# EAGLE schematic S140039_EMS_3HP_DS (EAGLE 6.5.0)

## Sheet 1 of 8: Backplane Layout
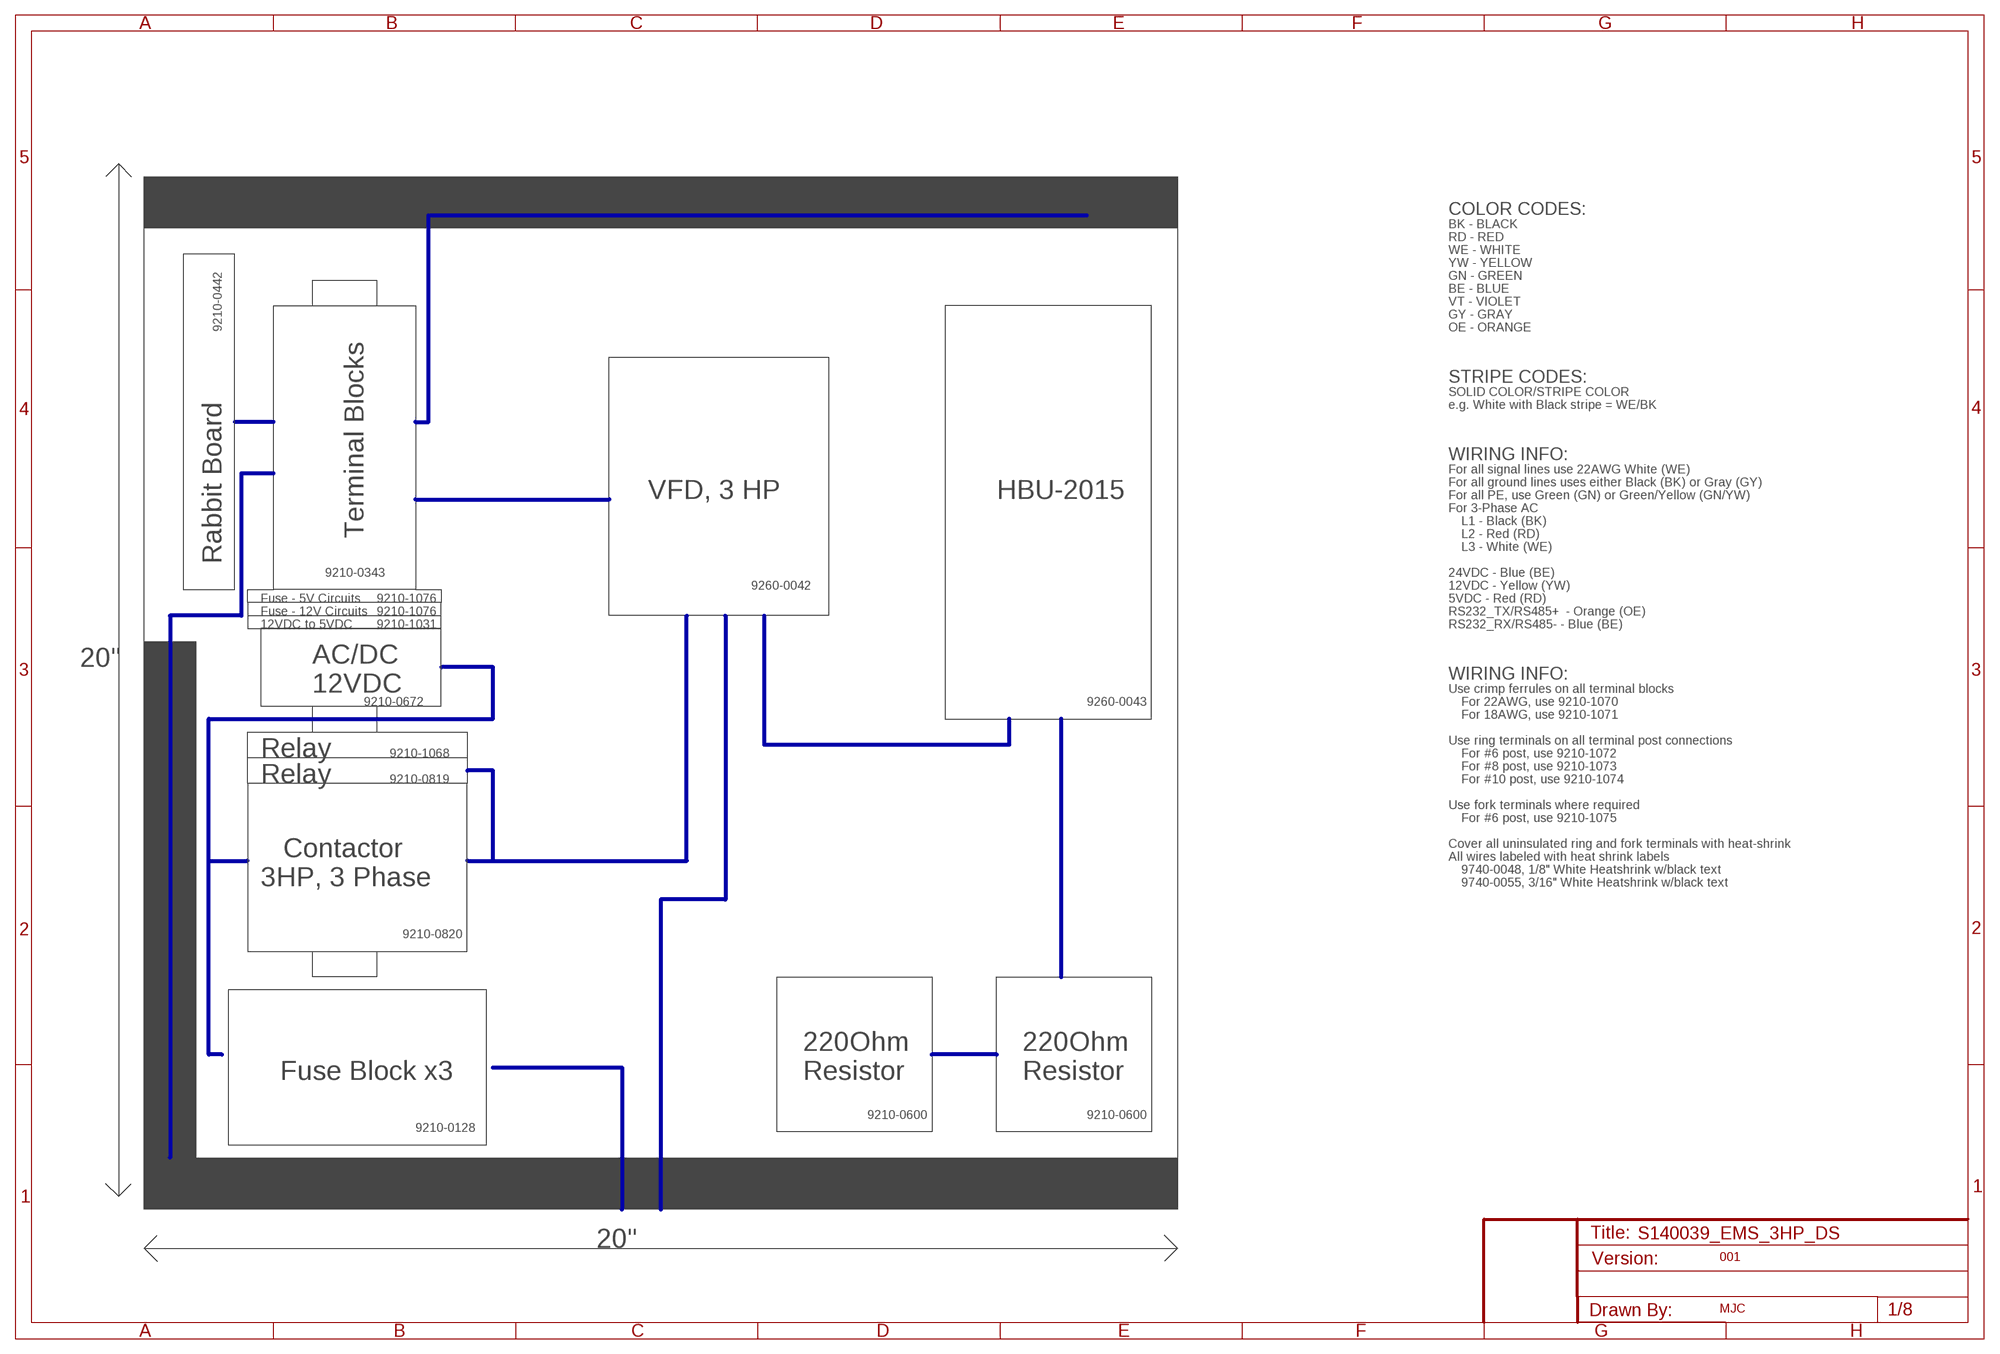
[diagram p0: schematic, sheet 1]

### Buses
B$1
B$2
B$3
B$6
B$7
B$8
B$9
B$10
B$11
B$12
B$4

### Notes on the sheet
- COLOR CODES:
- BK - BLACK
- RD - RED
- WE - WHITE
- YW - YELLOW
- GN - GREEN
- BE - BLUE
- VT - VIOLET
- GY - GRAY
- 9210-0442 | OE - ORANGE
- STRIPE CODES:
- SOLID COLOR/STRIPE COLOR
- e.g. White with Black stripe = WE/BK
- WIRING INFO:
- For all signal lines use 22AWG White (WE)
- For all ground lines uses either Black (BK) or Gray (GY)
- VFD, 3 HP | HBU-2015 | For all PE, use Green (GN) or Green/Yellow (GN/YW)
- For 3-Phase AC
- L1 - Black (BK)
- Terminal Blocks | L2 - Red (RD)
- L3 - White (WE)
- Rabbit Board
- 9210-0343 | 24VDC - Blue (BE)
- 9260-0042 | 12VDC - Yellow (YW)
- Fuse - 5V Circuits | 9210-1076 | 5VDC - Red (RD)
- Fuse - 12V Circuits | 9210-1076 | RS232_TX/RS485+  - Orange (OE)
- 12VDC to 5VDC | 9210-1031 | RS232_RX/RS485- - Blue (BE)
- 20"
- WIRING INFO:
- AC/DC 
  12VDC
- Use crimp ferrules on all terminal blocks
- 9210-0672 | 9260-0043 | For 22AWG, use 9210-1070
- For 18AWG, use 9210-1071
- Use ring terminals on all terminal post connections
- Relay | 9210-1068 | For #6 post, use 9210-1072
- For #8 post, use 9210-1073
- Relay | 9210-0819 | For #10 post, use 9210-1074
- Use fork terminals where required
- For #6 post, use 9210-1075
- Cover all uninsulated ring and fork terminals with heat-shrink
- All wires labeled with heat shrink labels
- 9740-0048, 1/8" White Heatshrink w/black text
- Contactor
  3HP, 3 Phase
- 9740-0055, 3/16" White Heatshrink w/black text
- 9210-0820
- Fuse Block x3
- 220Ohm
  Resistor
- 220Ohm
  Resistor
- 9210-0600 | 9210-0600
- 9210-0128
- 20"
- 001
- MJC

## Sheet 2 of 8: Terminal Blocks
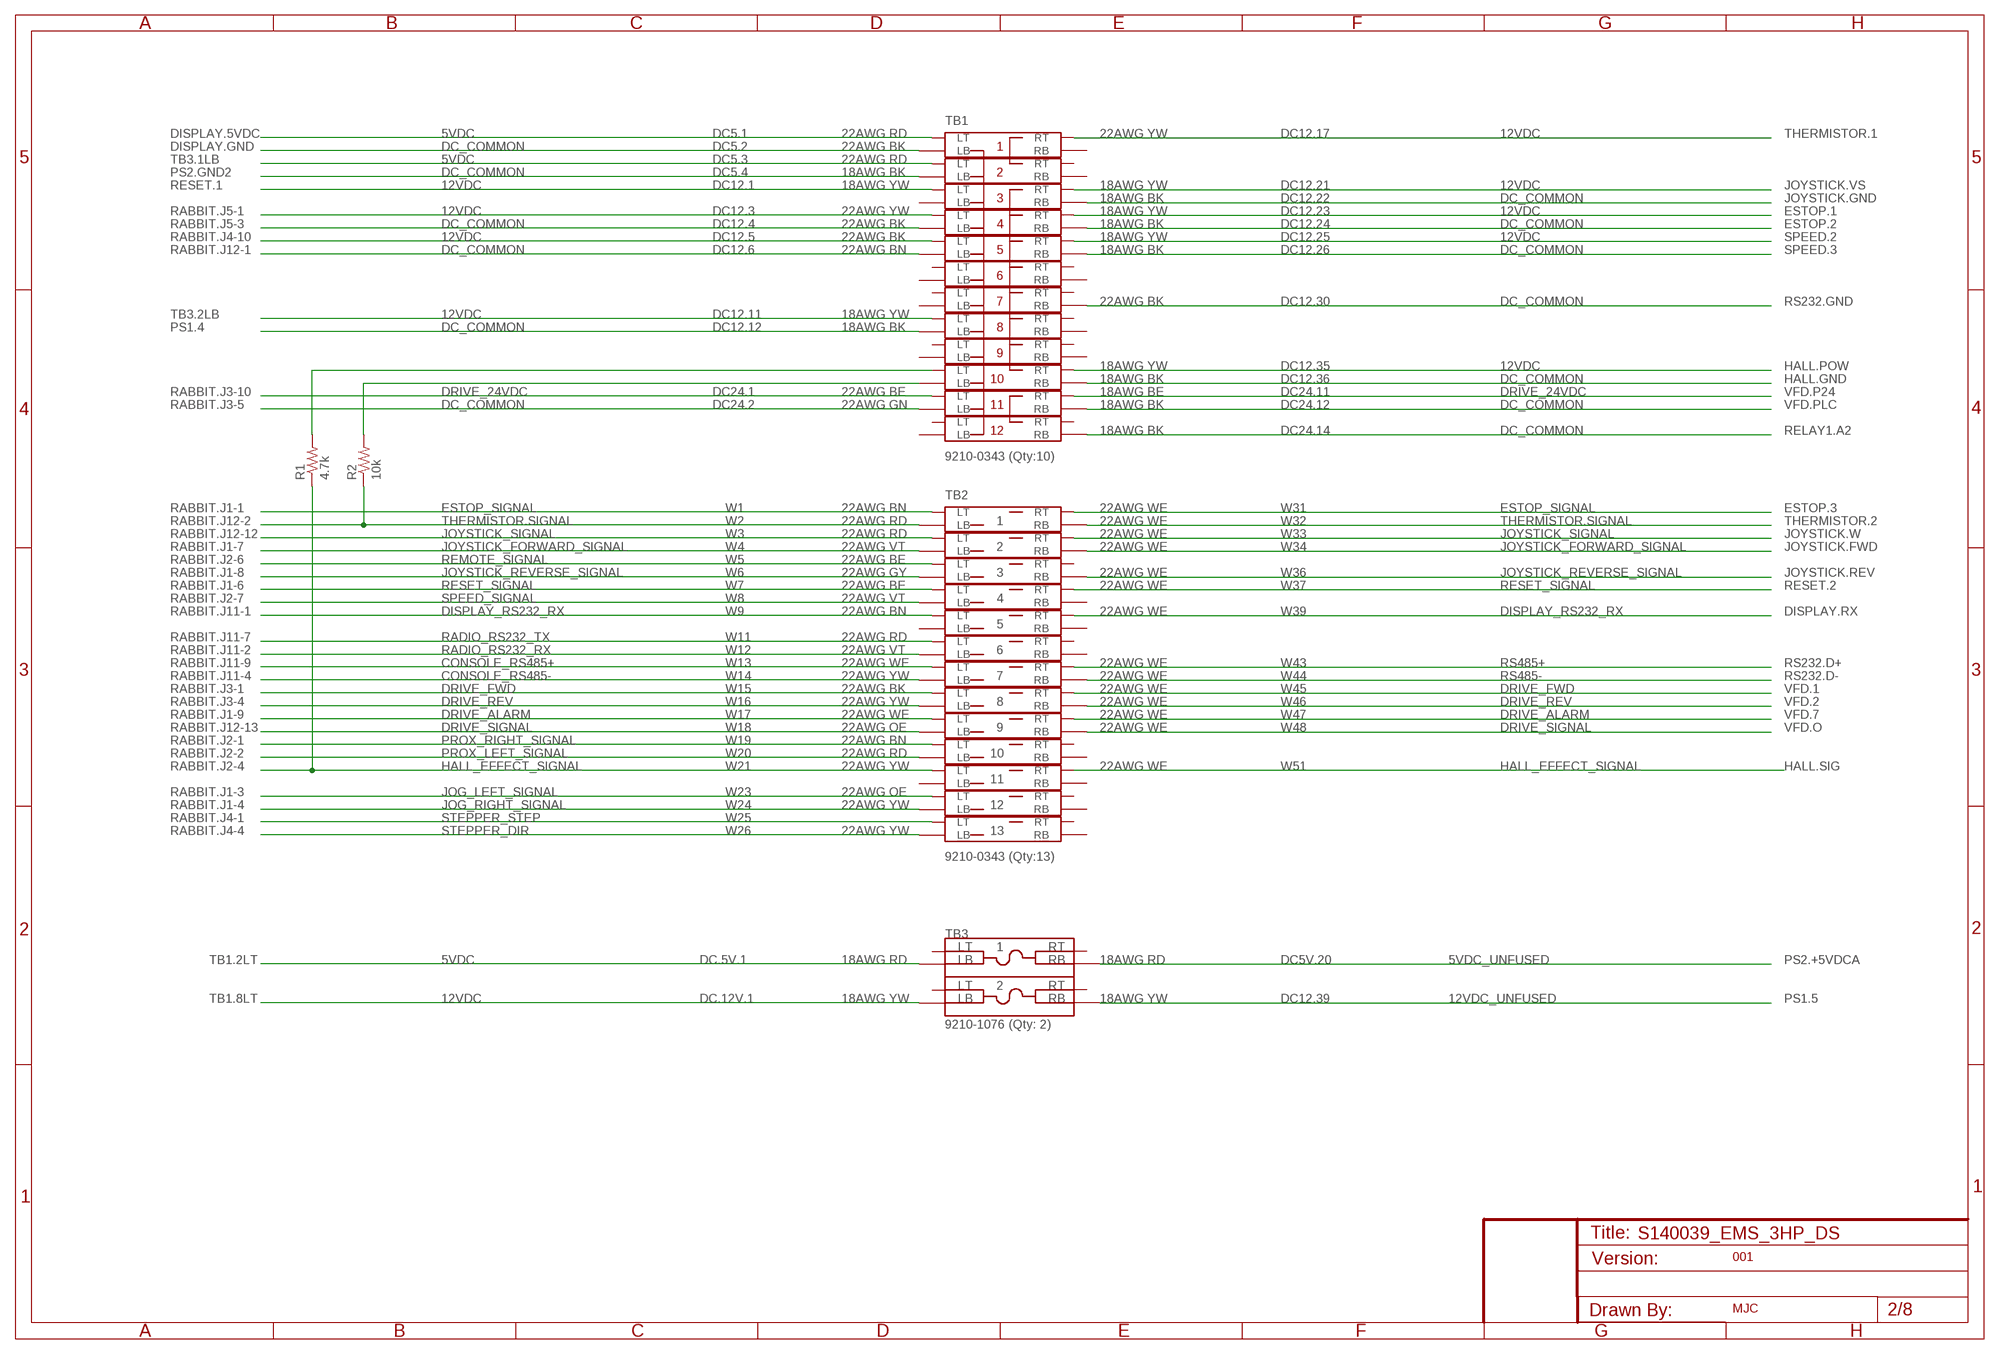
[diagram p1: schematic, sheet 2]

### Parts
R1  4.7k  R-US_0204/5  [0204/5]
R2  10k  R-US_0204/5  [0204/5]
U$1  TB_3031160_1POS  [BOGUS]
U$2  TB_3031160_1POS  [BOGUS]
U$4  TB_3031160_1POS  [BOGUS]
U$7  TB_3031160_1POS  [BOGUS]
U$8  TB_3031160_1POS  [BOGUS]
U$9  TB_FUSE_DDFL4ULR  [BOGUS]
U$10  TB_FUSE_DDFL4ULR  [BOGUS]
U$16  TB_3031160_1POS  [BOGUS]
U$17  TB_3031160_1POS  [BOGUS]
U$18  TB_3031160_1POS  [BOGUS]
U$19  TB_3031160_1POS  [BOGUS]
U$20  TB_3031160_1POS  [BOGUS]
U$21  TB_3031160_1POS  [BOGUS]
U$22  TB_3031160_1POS  [BOGUS]
U$23  TB_3031160_1POS  [BOGUS]
U$24  TB_3031160_1POS  [BOGUS]
U$25  TB_3031160_1POS  [BOGUS]
U$26  TB_3031160_1POS  [BOGUS]
U$27  TB_3031160_1POS  [BOGUS]
U$28  TB_3031160_1POS  [BOGUS]
U$29  TB_3031160_1POS  [BOGUS]
U$30  TB_3031160_1POS  [BOGUS]
U$31  TB_3031160_1POS  [BOGUS]
U$32  TB_3031160_1POS  [BOGUS]
U$33  TB_3031160_1POS  [BOGUS]
U$34  TB_3031160_1POS  [BOGUS]
U$35  TB_3031160_1POS  [BOGUS]

### Nets
5VDC: U$9.P$2 U$34.P$2(LT) U$35.P$2(LT) ; also sheet 7
5VDC_UNFUSED: U$9.P$4 ; also sheet 3
12VDC: U$8.P$4(RT) U$10.P$2 U$28.P$2(LT) U$31.P$2(LT) U$31.P$4(RT) U$32.P$2(LT) U$32.P$4(RT) U$33.P$2(LT) U$33.P$4(RT) U$35.P$4(RT) ; also sheet 4,6,7,8
12VDC_UNFUSED: U$10.P$4 ; also sheet 3
CONSOLE_RS485+: U$21.P$2(LT) ; also sheet 4,7
CONSOLE_RS485-: U$21.P$1(LB) ; also sheet 4,7
DC_COMMON: U$8.P$3(RB) U$26.P$3(RB) U$27.P$1(LB) U$27.P$3(RB) U$28.P$1(LB) U$29.P$3(RB) U$31.P$1(LB) U$31.P$3(RB) U$32.P$1(LB) U$32.P$3(RB) U$33.P$3(RB) U$34.P$1(LB) U$35.P$1(LB) ; also sheet 3,4,5,6,7,8
DISPLAY_RS232_RX: U$19.P$2(LT) U$19.P$4(RT) ; also sheet 7
DRIVE_24VDC: U$27.P$2(LT) U$27.P$4(RT) ; also sheet 4,5
DRIVE_ALARM: U$23.P$2(LT) U$23.P$4(RT) ; also sheet 4,5
DRIVE_FWD: U$22.P$2(LT) U$22.P$4(RT) ; also sheet 4,5
DRIVE_REV: U$22.P$1(LB) U$22.P$3(RB) ; also sheet 4,5
DRIVE_SIGNAL: U$23.P$1(LB) U$23.P$3(RB) ; also sheet 4,5
ESTOP_SIGNAL: U$4.P$2(LT) U$4.P$4(RT) ; also sheet 3,4,7
HALL_EFFECT_SIGNAL: R1.1 U$25.P$2(LT) U$25.P$4(RT) ; also sheet 4,8
JOG_LEFT_SIGNAL: U$1.P$2(LT) ; also sheet 4
JOG_RIGHT_SIGNAL: U$1.P$1(LB) ; also sheet 4
JOYSTICK_FORWARD_SIGNAL: U$16.P$1(LB) U$16.P$3(RB) ; also sheet 4,7
JOYSTICK_REVERSE_SIGNAL: U$17.P$1(LB) U$17.P$3(RB) ; also sheet 4,7
JOYSTICK_SIGNAL: U$16.P$2(LT) U$16.P$4(RT) ; also sheet 4,7
N$1: R2.2 U$8.P$1(LB)
N$2: R1.2 U$8.P$2(LT)
PROX_LEFT_SIGNAL: U$24.P$1(LB) ; also sheet 4,8
PROX_RIGHT_SIGNAL: U$24.P$2(LT) ; also sheet 4,8
RADIO_RS232_RX: U$20.P$1(LB) ; also sheet 4
RADIO_RS232_TX: U$20.P$2(LT) ; also sheet 4
REMOTE_SIGNAL: U$17.P$2(LT) ; also sheet 4
RESET_SIGNAL: U$18.P$2(LT) U$18.P$4(RT) ; also sheet 4,7
RS485+: U$21.P$4(RT)
RS485-: U$21.P$3(RB)
SPEED_SIGNAL: U$18.P$1(LB) ; also sheet 4
STEPPER_DIR: U$2.P$1(LB) ; also sheet 4
STEPPER_STEP: U$2.P$2(LT) ; also sheet 4
THERMISTOR.SIGNAL: R2.1 U$4.P$1(LB) U$4.P$3(RB) ; also sheet 4,6
Unconnected: U$1.P$3(RB) U$1.P$4(RT) U$2.P$3(RB) U$2.P$4(RT) U$7.P$1(LB) U$7.P$2(LT) U$7.P$3(RB) U$7.P$4(RT) U$9.P$1 U$9.P$3 U$10.P$1 U$10.P$3 U$17.P$4(RT) U$18.P$3(RB) U$19.P$1(LB) U$19.P$3(RB) U$20.P$3(RB) U$20.P$4(RT) U$24.P$3(RB) U$24.P$4(RT) U$25.P$1(LB) U$25.P$3(RB) U$26.P$1(LB) U$26.P$2(LT) U$26.P$4(RT) U$28.P$3(RB) U$28.P$4(RT) U$29.P$1(LB) U$29.P$2(LT) U$29.P$4(RT) U$30.P$1(LB) U$30.P$2(LT) U$30.P$3(RB) U$30.P$4(RT) U$33.P$1(LB) U$34.P$3(RB) U$34.P$4(RT) U$35.P$3(RB)

### Notes on the sheet
- TB1
- DISPLAY.5VDC | DC5.1 | 22AWG RD | 22AWG YW | DC12.17 | THERMISTOR.1
- DISPLAY.GND | DC5.2 | 22AWG BK | 1
- TB3.1LB | DC5.3 | 22AWG RD
- PS2.GND2 | DC5.4 | 18AWG BK | 2
- RESET.1 | DC12.1 | 18AWG YW | 18AWG YW | DC12.21 | JOYSTICK.VS
- 3 | 18AWG BK | DC12.22 | JOYSTICK.GND
- RABBIT.J5-1 | DC12.3 | 22AWG YW | 18AWG YW | DC12.23 | ESTOP.1
- RABBIT.J5-3 | DC12.4 | 22AWG BK | 4 | 18AWG BK | DC12.24 | ESTOP.2
- RABBIT.J4-10 | DC12.5 | 22AWG BK | 18AWG YW | DC12.25 | SPEED.2
- RABBIT.J12-1 | DC12.6 | 22AWG BN | 5 | 18AWG BK | DC12.26 | SPEED.3
- 6
- 7 | 22AWG BK | DC12.30 | RS232.GND
- TB3.2LB | DC12.11 | 18AWG YW
- PS1.4 | DC12.12 | 18AWG BK | 8
- 9
- 18AWG YW | DC12.35 | HALL.POW
- 10 | 18AWG BK | DC12.36 | HALL.GND
- RABBIT.J3-10 | DC24.1 | 22AWG BE | 18AWG BE | DC24.11 | VFD.P24
- RABBIT.J3-5 | DC24.2 | 22AWG GN | 11 | 18AWG BK | DC24.12 | VFD.PLC
- 12 | 18AWG BK | DC24.14 | RELAY1.A2
- 9210-0343 (Qty:10)
- TB2
- RABBIT.J1-1 | W1 | 22AWG BN | 22AWG WE | W31 | ESTOP.3
- RABBIT.J12-2 | W2 | 22AWG RD | 1 | 22AWG WE | W32 | THERMISTOR.2
- RABBIT.J12-12 | W3 | 22AWG RD | 22AWG WE | W33 | JOYSTICK.W
- RABBIT.J1-7 | W4 | 22AWG VT | 2 | 22AWG WE | W34 | JOYSTICK.FWD
- RABBIT.J2-6 | W5 | 22AWG BE
- RABBIT.J1-8 | W6 | 22AWG GY | 3 | 22AWG WE | W36 | JOYSTICK.REV
- RABBIT.J1-6 | W7 | 22AWG BE | 22AWG WE | W37 | RESET.2
- RABBIT.J2-7 | W8 | 22AWG VT | 4
- RABBIT.J11-1 | W9 | 22AWG BN | 22AWG WE | W39 | DISPLAY.RX
- 5
- RABBIT.J11-7 | W11 | 22AWG RD
- RABBIT.J11-2 | W12 | 22AWG VT | 6
- RABBIT.J11-9 | W13 | 22AWG WE | 22AWG WE | W43 | RS232.D+
- RABBIT.J11-4 | W14 | 22AWG YW | 7 | 22AWG WE | W44 | RS232.D-
- RABBIT.J3-1 | W15 | 22AWG BK | 22AWG WE | W45 | VFD.1
- RABBIT.J3-4 | W16 | 22AWG YW | 8 | 22AWG WE | W46 | VFD.2
- RABBIT.J1-9 | W17 | 22AWG WE | 22AWG WE | W47 | VFD.7
- RABBIT.J12-13 | W18 | 22AWG OE | 9 | 22AWG WE | W48 | VFD.O
- RABBIT.J2-1 | W19 | 22AWG BN
- RABBIT.J2-2 | W20 | 22AWG RD | 10
- RABBIT.J2-4 | W21 | 22AWG YW | 22AWG WE | W51 | HALL.SIG
- 11
- RABBIT.J1-3 | W23 | 22AWG OE
- RABBIT.J1-4 | W24 | 22AWG YW | 12
- RABBIT.J4-1 | W25
- RABBIT.J4-4 | W26 | 22AWG YW | 13
- 9210-0343 (Qty:13)
- TB3
- 1
- TB1.2LT | DC.5V.1 | 18AWG RD | 18AWG RD | DC5V.20 | PS2.+5VDCA
- 2
- TB1.8LT | DC.12V.1 | 18AWG YW | 18AWG YW | DC12.39 | PS1.5
- 9210-1076 (Qty: 2)
- 001
- MJC

## Sheet 3 of 8: Power Supplies
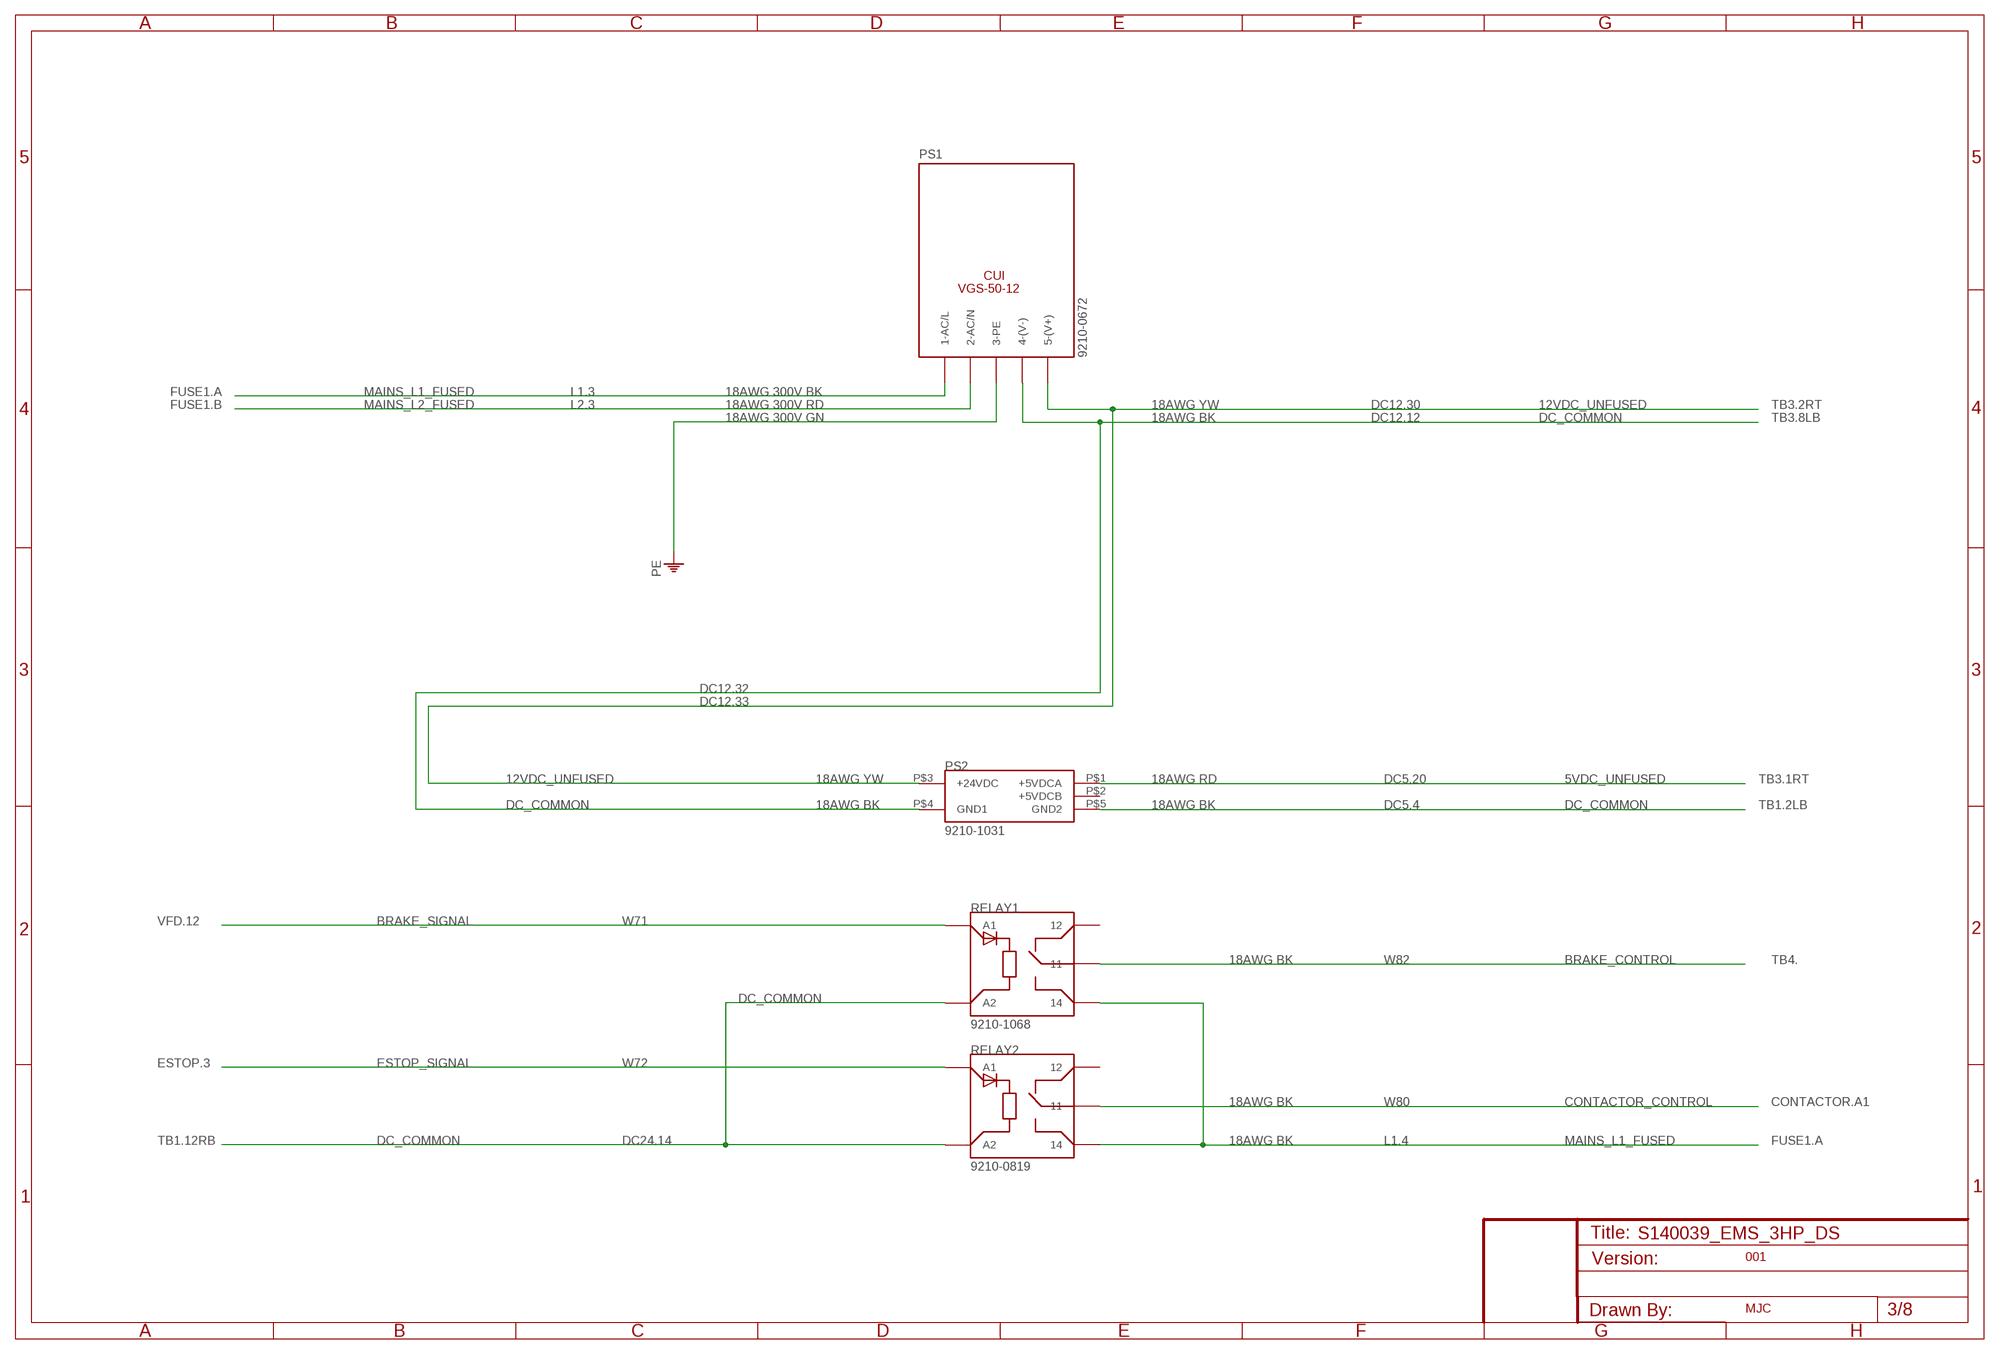
[diagram p2: schematic, sheet 3]

### Parts
PS1  DC-DC_CONVERTER_VGS-50-12  [BOGUS]
PS2  DC-DC_CONVERTER_24V-5V  [BOGUS]
RELAY1  RELAY_TB  [BOGUS]
RELAY2  RELAY_TB  [BOGUS]

### Nets
5VDC_UNFUSED: PS2.P$1(+5VDCA) ; also sheet 2
12VDC_UNFUSED: PS1.P$5(5-(V+)) PS2.P$3(+24VDC) ; also sheet 2
BRAKE_CONTROL: RELAY1.P$1 ; also sheet 6
BRAKE_SIGNAL: RELAY1.P$4(A1) ; also sheet 5
CONTACTOR_CONTROL: RELAY2.P$1 ; also sheet 6
DC_COMMON: PS1.P$4(4-(V-)) PS2.P$4(GND1) PS2.P$5(GND2) RELAY1.P$5(A2) RELAY2.P$5(A2) ; also sheet 2,4,5,6,7,8
ESTOP_SIGNAL: RELAY2.P$4(A1) ; also sheet 2,4,7
MAINS_L1_FUSED: PS1.P$1(1-AC/L) RELAY1.P$3 RELAY2.P$3 ; also sheet 5,6
MAINS_L2_FUSED: PS1.P$2(2-AC/N) ; also sheet 5,6
PE: PS1.P$3(3-PE)
Unconnected: PS2.P$2(+5VDCB) RELAY1.P$2 RELAY2.P$2

### Notes on the sheet
- 9210-0672
- FUSE1.A | L1.3 | 18AWG 300V BK
- FUSE1.B | L2.3 | 18AWG 300V RD | 18AWG YW | DC12.30 | TB3.2RT
- 18AWG 300V GN | 18AWG BK | DC12.12 | TB3.8LB
- DC12.32
- DC12.33
- 18AWG YW | 18AWG RD | DC5.20 | TB3.1RT
- 18AWG BK | 18AWG BK | DC5.4 | TB1.2LB
- 9210-1031
- VFD.12 | W71
- 18AWG BK | W82 | TB4.
- 9210-1068
- ESTOP.3 | W72
- 18AWG BK | W80 | CONTACTOR.A1
- TB1.12RB | DC24.14 | 18AWG BK | L1.4 | FUSE1.A
- 9210-0819
- 001
- MJC

## Sheet 4 of 8: Rabbit Board Wiring
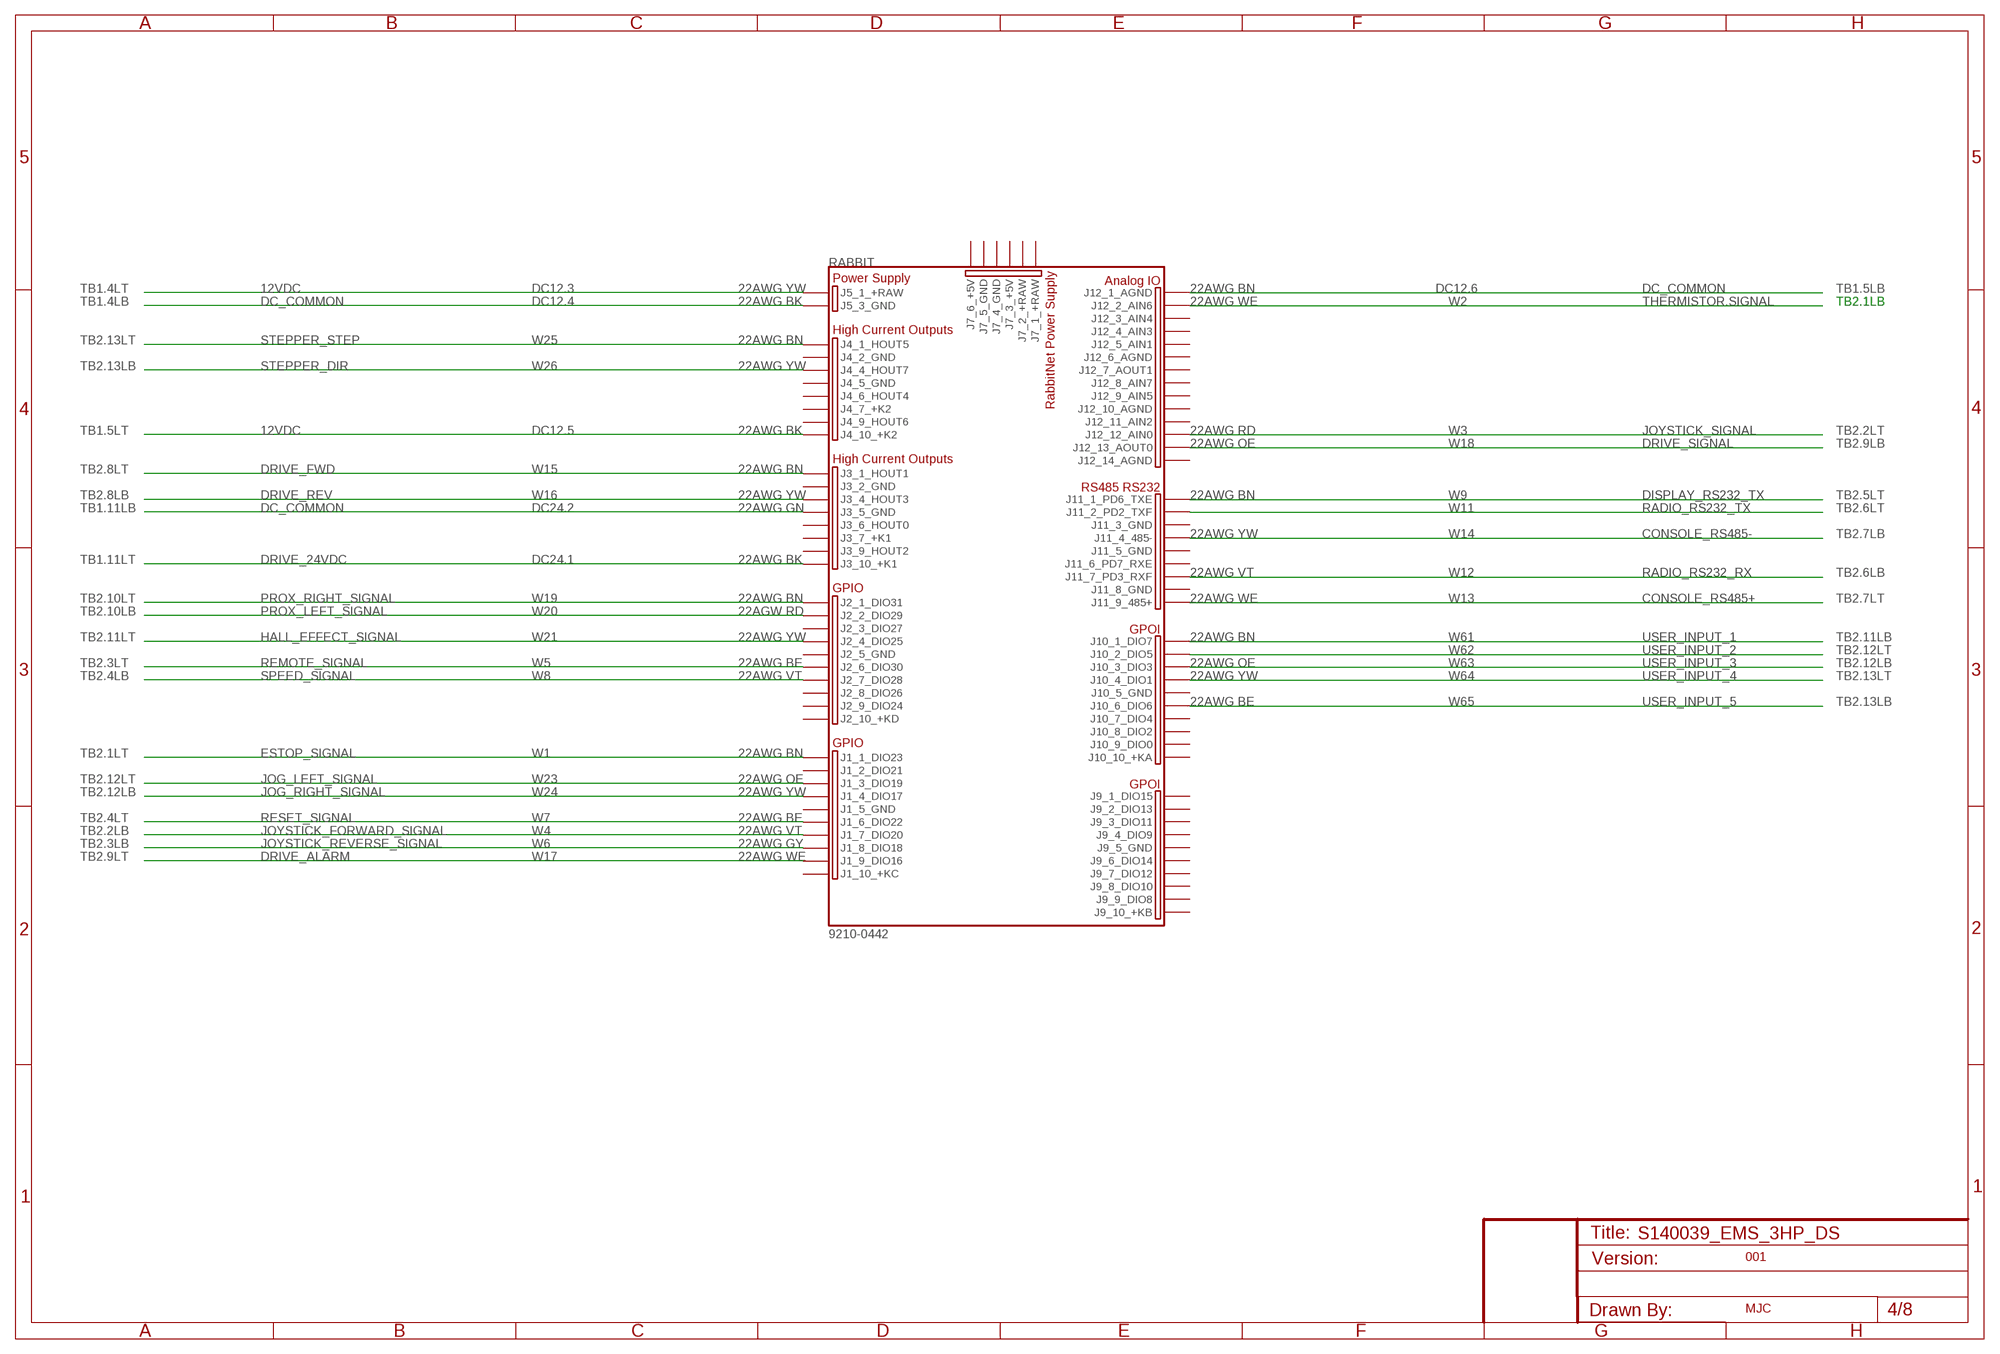
[diagram p3: schematic, sheet 4]

### Parts
CPU1  RABBIT_BL4S200(RCM4310)  [RABBIT_BL4S200]

### Nets
12VDC: CPU1.P$J4-10(J4_10_+K2) CPU1.P$J5-1(J5_1_+RAW) ; also sheet 2,6,7,8
CONSOLE_RS485+: CPU1.P$J11-9(J11_9_485+) ; also sheet 2,7
CONSOLE_RS485-: CPU1.P$J11-4(J11_4_485-) ; also sheet 2,7
DC_COMMON: CPU1.P$J3-5(J3_5_GND) CPU1.P$J5-3(J5_3_GND) CPU1.P$J12-1(J12_1_AGND) ; also sheet 2,3,5,6,7,8
DISPLAY_RS232_TX: CPU1.P$J11-1(J11_1_PD6_TXE)
DRIVE_24VDC: CPU1.P$J3-10(J3_10_+K1) ; also sheet 2,5
DRIVE_ALARM: CPU1.P$J1-9(J1_9_DIO16) ; also sheet 2,5
DRIVE_FWD: CPU1.P$J3-1(J3_1_HOUT1) ; also sheet 2,5
DRIVE_REV: CPU1.P$J3-4(J3_4_HOUT3) ; also sheet 2,5
DRIVE_SIGNAL: CPU1.P$J12-13(J12_13_AOUT0) ; also sheet 2,5
ESTOP_SIGNAL: CPU1.P$J1-1(J1_1_DIO23) ; also sheet 2,3,7
HALL_EFFECT_SIGNAL: CPU1.P$J2-4(J2_4_DIO25) ; also sheet 2,8
JOG_LEFT_SIGNAL: CPU1.P$J1-3(J1_3_DIO19) ; also sheet 2
JOG_RIGHT_SIGNAL: CPU1.P$J1-4(J1_4_DIO17) ; also sheet 2
JOYSTICK_FORWARD_SIGNAL: CPU1.P$J1-7(J1_7_DIO20) ; also sheet 2,7
JOYSTICK_REVERSE_SIGNAL: CPU1.P$J1-8(J1_8_DIO18) ; also sheet 2,7
JOYSTICK_SIGNAL: CPU1.P$J12-12(J12_12_AIN0) ; also sheet 2,7
PROX_LEFT_SIGNAL: CPU1.P$J2-2(J2_2_DIO29) ; also sheet 2,8
PROX_RIGHT_SIGNAL: CPU1.P$J2-1(J2_1_DIO31) ; also sheet 2,8
RADIO_RS232_RX: CPU1.P$J11-7(J11_7_PD3_RXF) ; also sheet 2
RADIO_RS232_TX: CPU1.P$J11-2(J11_2_PD2_TXF) ; also sheet 2
REMOTE_SIGNAL: CPU1.P$J2-6(J2_6_DIO30) ; also sheet 2
RESET_SIGNAL: CPU1.P$J1-6(J1_6_DIO22) ; also sheet 2,7
SPEED_SIGNAL: CPU1.P$J2-7(J2_7_DIO28) ; also sheet 2
STEPPER_DIR: CPU1.P$J4-4(J4_4_HOUT7) ; also sheet 2
STEPPER_STEP: CPU1.P$J4-1(J4_1_HOUT5) ; also sheet 2
THERMISTOR.SIGNAL: CPU1.P$J12-2(J12_2_AIN6) ; also sheet 2,6
USER_INPUT_1: CPU1.P$J10-1(J10_1_DIO7)
USER_INPUT_2: CPU1.P$J10-2(J10_2_DIO5)
USER_INPUT_3: CPU1.P$J10-3(J10_3_DIO3)
USER_INPUT_4: CPU1.P$J10-4(J10_4_DIO1)
USER_INPUT_5: CPU1.P$J10-6(J10_6_DIO6)
Unconnected: CPU1.P$J1-2(J1_2_DIO21) CPU1.P$J1-5(J1_5_GND) CPU1.P$J1-10(J1_10_+KC) CPU1.P$J2-3(J2_3_DIO27) CPU1.P$J2-5(J2_5_GND) CPU1.P$J2-8(J2_8_DIO26) CPU1.P$J2-9(J2_9_DIO24) CPU1.P$J2-10(J2_10_+KD) CPU1.P$J3-2(J3_2_GND) CPU1.P$J3-6(J3_6_HOUT0) CPU1.P$J3-7(J3_7_+K1) CPU1.P$J3-9(J3_9_HOUT2) CPU1.P$J4-2(J4_2_GND) CPU1.P$J4-5(J4_5_GND) CPU1.P$J4-6(J4_6_HOUT4) CPU1.P$J4-7(J4_7_+K2) CPU1.P$J4-9(J4_9_HOUT6) CPU1.P$J7-1(J7_1_+RAW) CPU1.P$J7-2(J7_2_+RAW) CPU1.P$J7-3(J7_3_+5V) CPU1.P$J7-4(J7_4_GND) CPU1.P$J7-5(J7_5_GND) CPU1.P$J7-6(J7_6_+5V) CPU1.P$J9-1(J9_1_DIO15) CPU1.P$J9-2(J9_2_DIO13) CPU1.P$J9-3(J9_3_DIO11) CPU1.P$J9-4(J9_4_DIO9) CPU1.P$J9-5(J9_5_GND) CPU1.P$J9-6(J9_6_DIO14) CPU1.P$J9-7(J9_7_DIO12) CPU1.P$J9-8(J9_8_DIO10) CPU1.P$J9-9(J9_9_DIO8) CPU1.P$J9-10(J9_10_+KB) CPU1.P$J10-5(J10_5_GND) CPU1.P$J10-7(J10_7_DIO4) CPU1.P$J10-8(J10_8_DIO2) CPU1.P$J10-9(J10_9_DIO0) CPU1.P$J10-10(J10_10_+KA) CPU1.P$J11-3(J11_3_GND) CPU1.P$J11-5(J11_5_GND) CPU1.P$J11-6(J11_6_PD7_RXE) CPU1.P$J11-8(J11_8_GND) CPU1.P$J12-3(J12_3_AIN4) CPU1.P$J12-4(J12_4_AIN3) CPU1.P$J12-5(J12_5_AIN1) CPU1.P$J12-6(J12_6_AGND) CPU1.P$J12-7(J12_7_AOUT1) CPU1.P$J12-8(J12_8_AIN7) CPU1.P$J12-9(J12_9_AIN5) CPU1.P$J12-10(J12_10_AGND) CPU1.P$J12-11(J12_11_AIN2) CPU1.P$J12-14(J12_14_AGND)

### Notes on the sheet
- RABBIT
- TB1.4LT | DC12.3 | 22AWG YW | 22AWG BN | DC12.6 | TB1.5LB
- TB1.4LB | DC12.4 | 22AWG BK | 22AWG WE | W2 | TB2.1LB
- TB2.13LT | W25 | 22AWG BN
- TB2.13LB | W26 | 22AWG YW
- TB1.5LT | DC12.5 | 22AWG BK | 22AWG RD | W3 | TB2.2LT
- 22AWG OE | W18 | TB2.9LB
- TB2.8LT | W15 | 22AWG BN
- TB2.8LB | W16 | 22AWG YW | 22AWG BN | W9 | TB2.5LT
- TB1.11LB | DC24.2 | 22AWG GN | W11 | TB2.6LT
- 22AWG YW | W14 | TB2.7LB
- TB1.11LT | DC24.1 | 22AWG BK
- 22AWG VT | W12 | TB2.6LB
- TB2.10LT | W19 | 22AWG BN | 22AWG WE | W13 | TB2.7LT
- TB2.10LB | W20 | 22AGW RD
- TB2.11LT | W21 | 22AWG YW | 22AWG BN | W61 | TB2.11LB
- W62 | TB2.12LT
- TB2.3LT | W5 | 22AWG BE | 22AWG OE | W63 | TB2.12LB
- TB2.4LB | W8 | 22AWG VT | 22AWG YW | W64 | TB2.13LT
- 22AWG BE | W65 | TB2.13LB
- TB2.1LT | W1 | 22AWG BN
- TB2.12LT | W23 | 22AWG OE
- TB2.12LB | W24 | 22AWG YW
- TB2.4LT | W7 | 22AWG BE
- TB2.2LB | W4 | 22AWG VT
- TB2.3LB | W6 | 22AWG GY
- TB2.9LT | W17 | 22AWG WE
- 9210-0442
- 001
- MJC

## Sheet 5 of 8: VFD - Hitachi
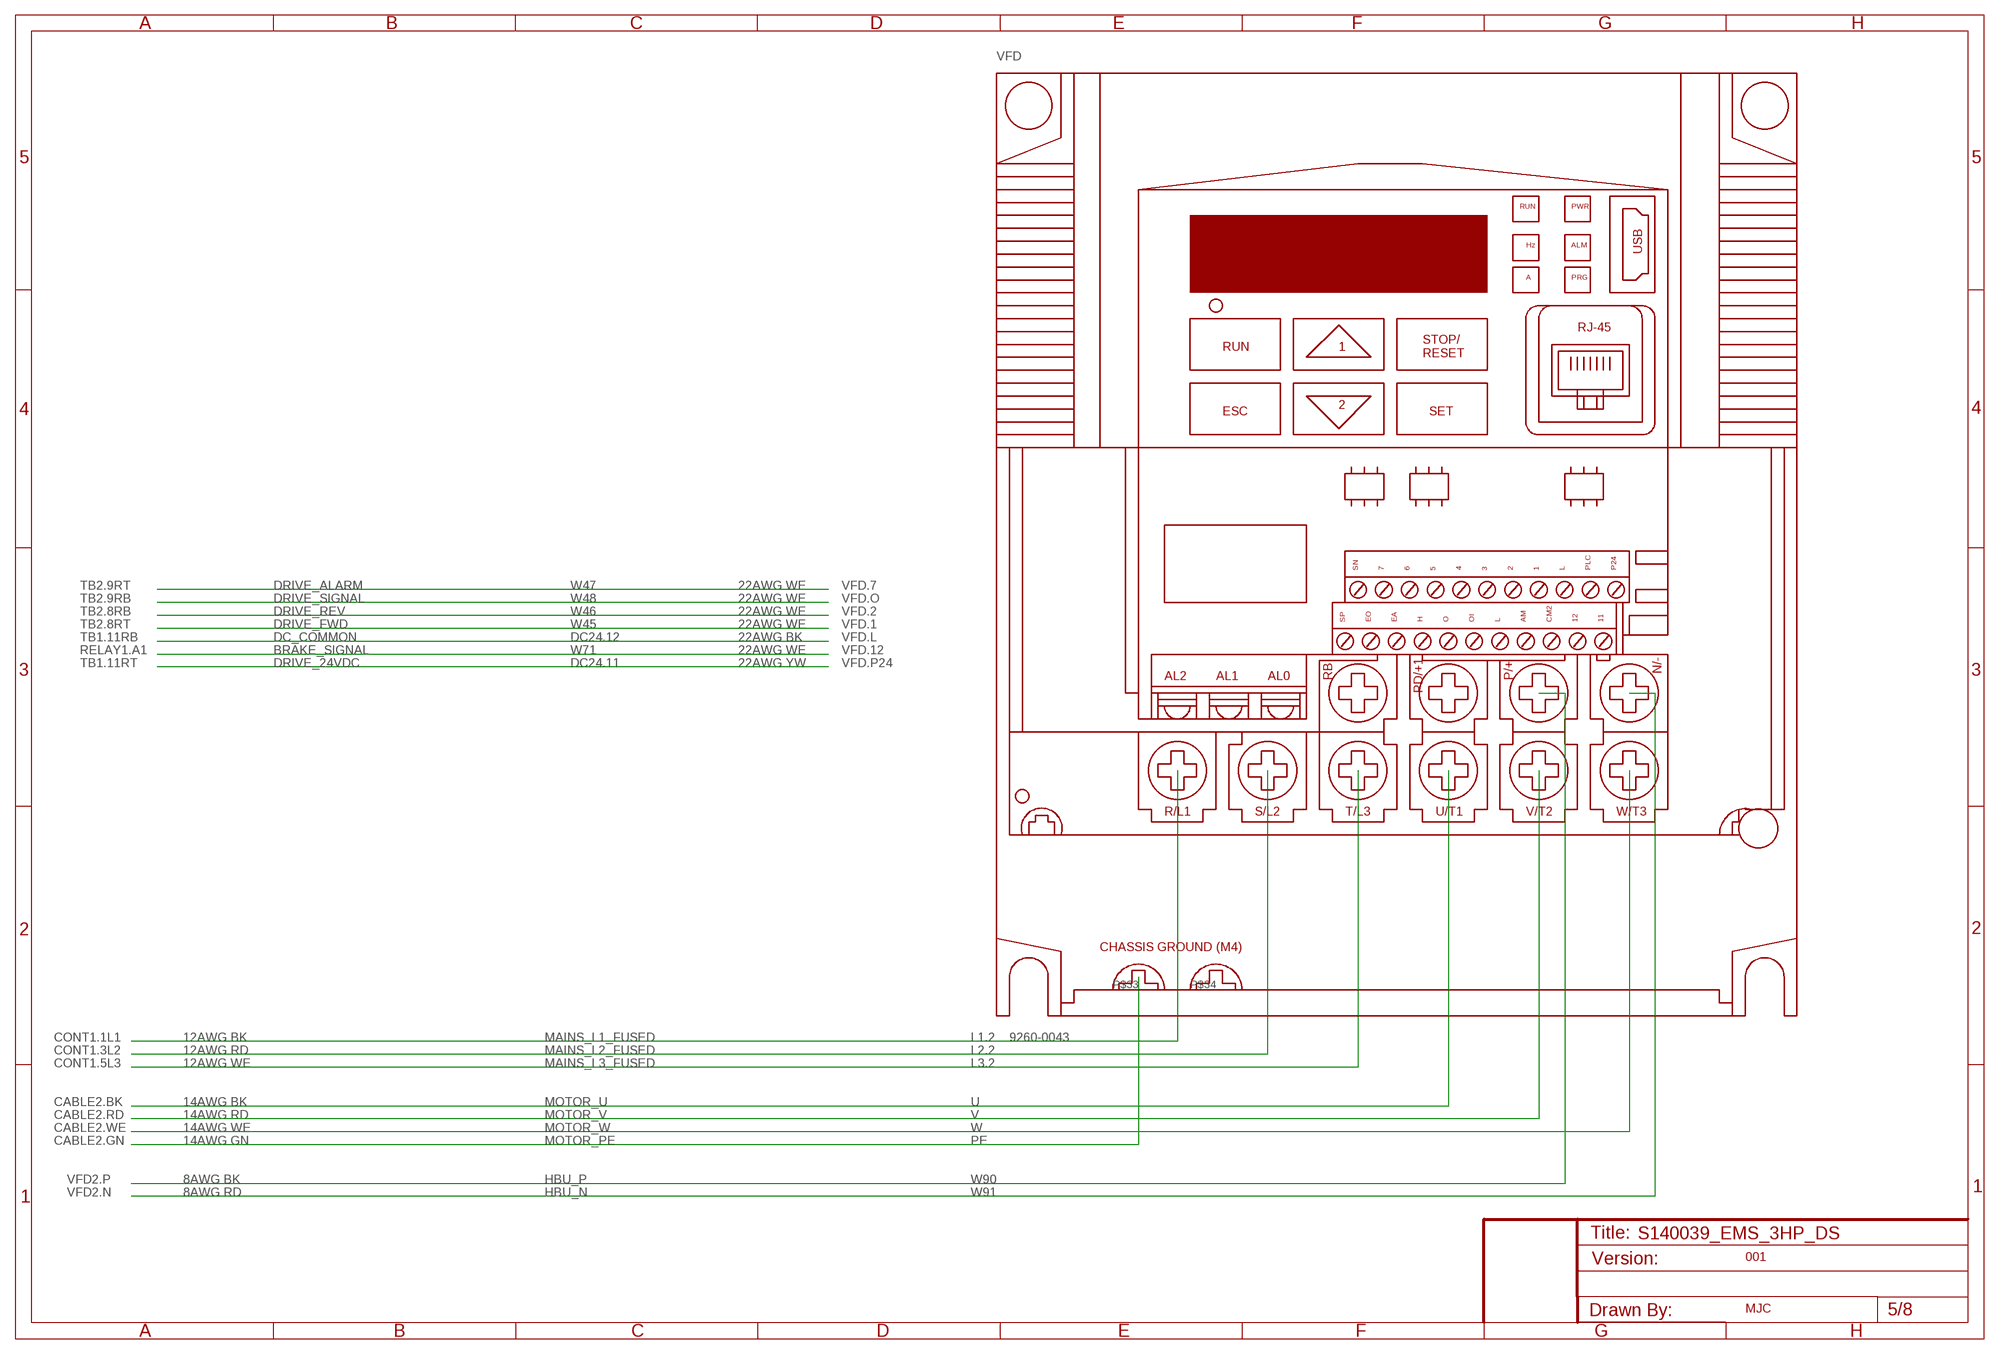
[diagram p4: schematic, sheet 5]

### Parts
VFD  HITACHI_WJ200-022LF  [BOGUS]

### Nets
HBU_N: VFD.P$29 ; also sheet 6
HBU_P: VFD.P$28 ; also sheet 6
MAINS_L1_FUSED: VFD.P$23 ; also sheet 3,6
MAINS_L2_FUSED: VFD.P$24 ; also sheet 3,6
MAINS_L3_FUSED: VFD.P$25 ; also sheet 6
MOTOR_U: VFD.P$32 ; also sheet 8
MOTOR_V: VFD.P$31 ; also sheet 8
MOTOR_W: VFD.P$30 ; also sheet 8
Unconnected: VFD.P$1 VFD.P$2 VFD.P$3 VFD.P$4 VFD.P$5 VFD.P$6 VFD.P$7 VFD.P$8 VFD.P$9 VFD.P$10 VFD.P$11 VFD.P$12 VFD.P$13 VFD.P$14 VFD.P$15 VFD.P$16 VFD.P$17 VFD.P$18 VFD.P$19 VFD.P$20 VFD.P$21 VFD.P$22 VFD.P$26 VFD.P$27 VFD.P$33 VFD.P$34

### Notes on the sheet
- TB2.9RT | W47 | 22AWG WE | VFD.7
- TB2.9RB | W48 | 22AWG WE | VFD.O
- TB2.8RB | W46 | 22AWG WE | VFD.2
- TB2.8RT | W45 | 22AWG WE | VFD.1
- TB1.11RB | DC24.12 | 22AWG BK | VFD.L
- RELAY1.A1 | W71 | 22AWG WE | VFD.12
- TB1.11RT | DC24.11 | 22AWG YW | VFD.P24
- CONT1.1L1 | 12AWG BK | L1.2 | 9260-0043
- CONT1.3L2 | 12AWG RD | L2.2
- CONT1.5L3 | 12AWG WE | L3.2
- CABLE2.BK | 14AWG BK | U
- CABLE2.RD | 14AWG RD | V
- CABLE2.WE | 14AWG WE | W
- CABLE2.GN | 14AWG GN | PE
- VFD2.P | 8AWG BK | W90
- VFD2.N | 8AWG RD | W91
- 001
- MJC

## Sheet 6 of 8: HBU & Dynamic Brake Resistors
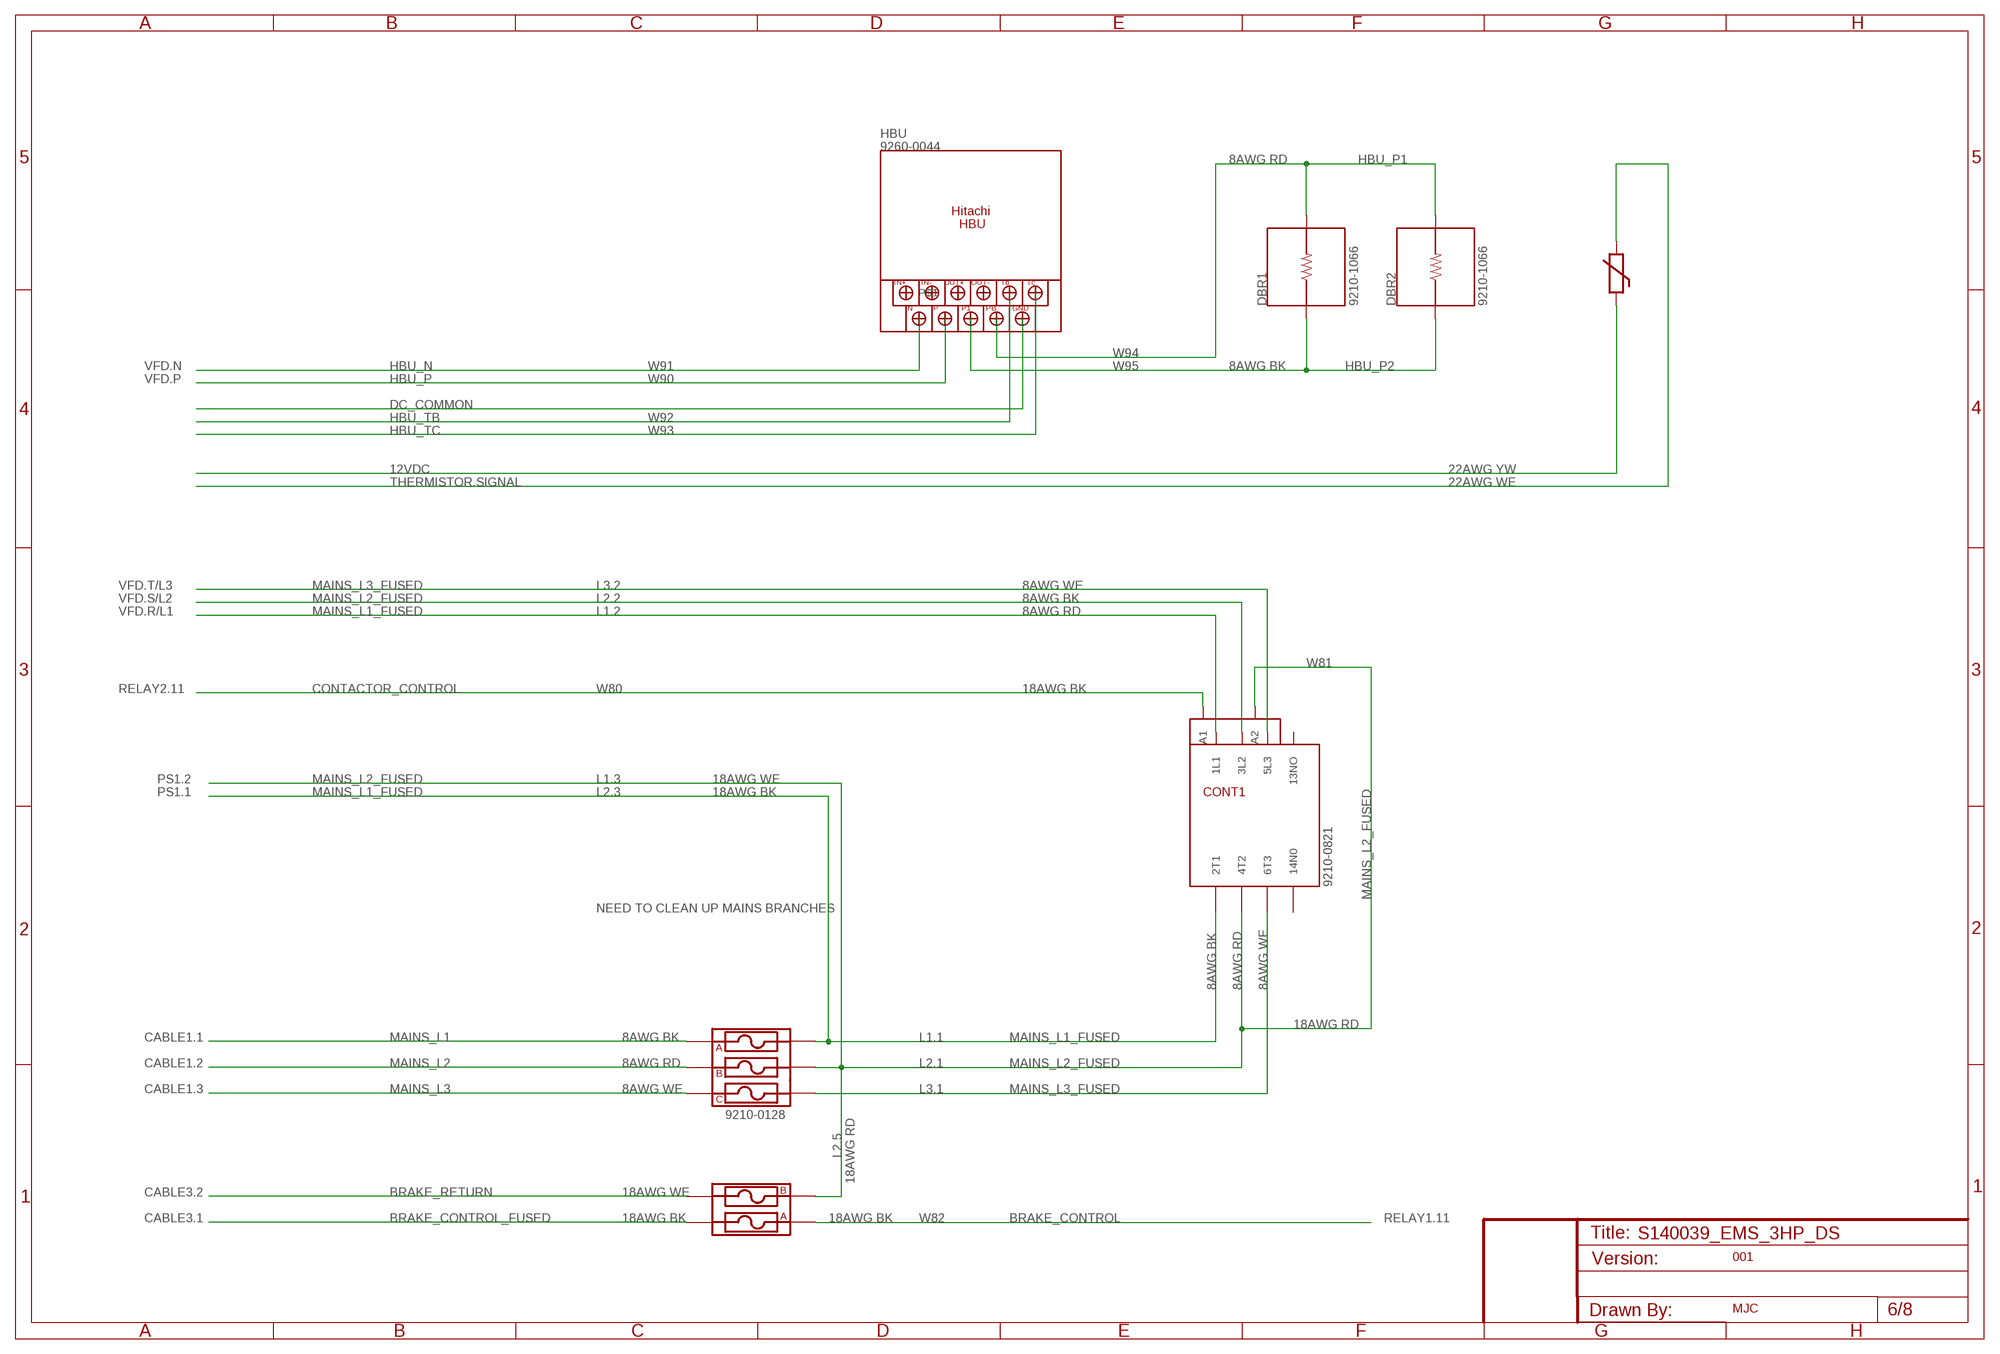
[diagram p5: schematic, sheet 6]

### Parts
CONT1  CONTACTOR_3PHASE  [BOGUS]
DBR1  100 Ohm  R-DYNAMIC_BRAKE  [0204/5]
DBR2  100 Ohm  R-DYNAMIC_BRAKE  [0204/5]
FUSE1  FUSE_HOLDER_3-POLE  [BOGUS]
HBU  HITACHI_HBU-2030  [BOGUS]
U$6  FUSE_HOLDER_2-POLE  [BOGUS]
U$14  THERMISTOR  [BOGUS]

### Nets
12VDC: U$14.P$2 ; also sheet 2,4,7,8
BRAKE_CONTROL: U$6.P$2 ; also sheet 3
BRAKE_CONTROL_FUSED: U$6.P$3 ; also sheet 8
BRAKE_RETURN: U$6.P$4 ; also sheet 8
CONTACTOR_CONTROL: CONT1.P$9(A1) ; also sheet 3
DC_COMMON: HBU.P$7 ; also sheet 2,3,4,5,7,8
HBU_N: HBU.P$11 ; also sheet 5
HBU_P: HBU.P$10 ; also sheet 5
HBU_P1: DBR1.2 DBR2.2 HBU.P$8
HBU_P2: DBR1.1 DBR2.1 HBU.P$9
HBU_TB: HBU.P$5
HBU_TC: HBU.P$6
MAINS_L1: FUSE1.P$2 ; also sheet 8
MAINS_L1_FUSED: CONT1.P$1(1L1) CONT1.P$2(2T1) FUSE1.P$3 ; also sheet 3,5
MAINS_L2: FUSE1.P$1 ; also sheet 8
MAINS_L2_FUSED: CONT1.P$3(3L2) CONT1.P$4(4T2) CONT1.P$10(A2) FUSE1.P$4 U$6.P$1 ; also sheet 3,5
MAINS_L3: FUSE1.P$5 ; also sheet 8
MAINS_L3_FUSED: CONT1.P$5(5L3) CONT1.P$6(6T3) FUSE1.P$6 ; also sheet 5
THERMISTOR.SIGNAL: U$14.P$1 ; also sheet 2,4
Unconnected: CONT1.P$7(13NO) CONT1.P$8(14N0) HBU.P$1 HBU.P$2 HBU.P$3 HBU.P$4

### Notes on the sheet
- 9260-0044
- 8AWG RD
- 9210-1066 | 9210-1066
- W94
- VFD.N | W91 | W95 | 8AWG BK
- VFD.P | W90
- W92
- W93
- 22AWG YW
- 22AWG WE
- VFD.T/L3 | L3.2 | 8AWG WE
- VFD.S/L2 | L2.2 | 8AWG BK
- VFD.R/L1 | L1.2 | 8AWG RD
- W81
- RELAY2.11 | W80 | 18AWG BK
- PS1.2 | L1.3 | 18AWG WE
- PS1.1 | L2.3 | 18AWG BK
- 9210-0821
- NEED TO CLEAN UP MAINS BRANCHES
- 8AWG BK | 8AWG RD | 8AWG WE
- 18AWG RD
- CABLE1.1 | 8AWG BK | L1.1
- CABLE1.2 | 8AWG RD | L2.1
- CABLE1.3 | 8AWG WE | L3.1
- 9210-0128
- L2.5
- 18AWG RD
- CABLE3.2 | 18AWG WE
- CABLE3.1 | 18AWG BK | 18AWG BK | W82 | RELAY1.11
- 001
- MJC

## Sheet 7 of 8: Interface Connections
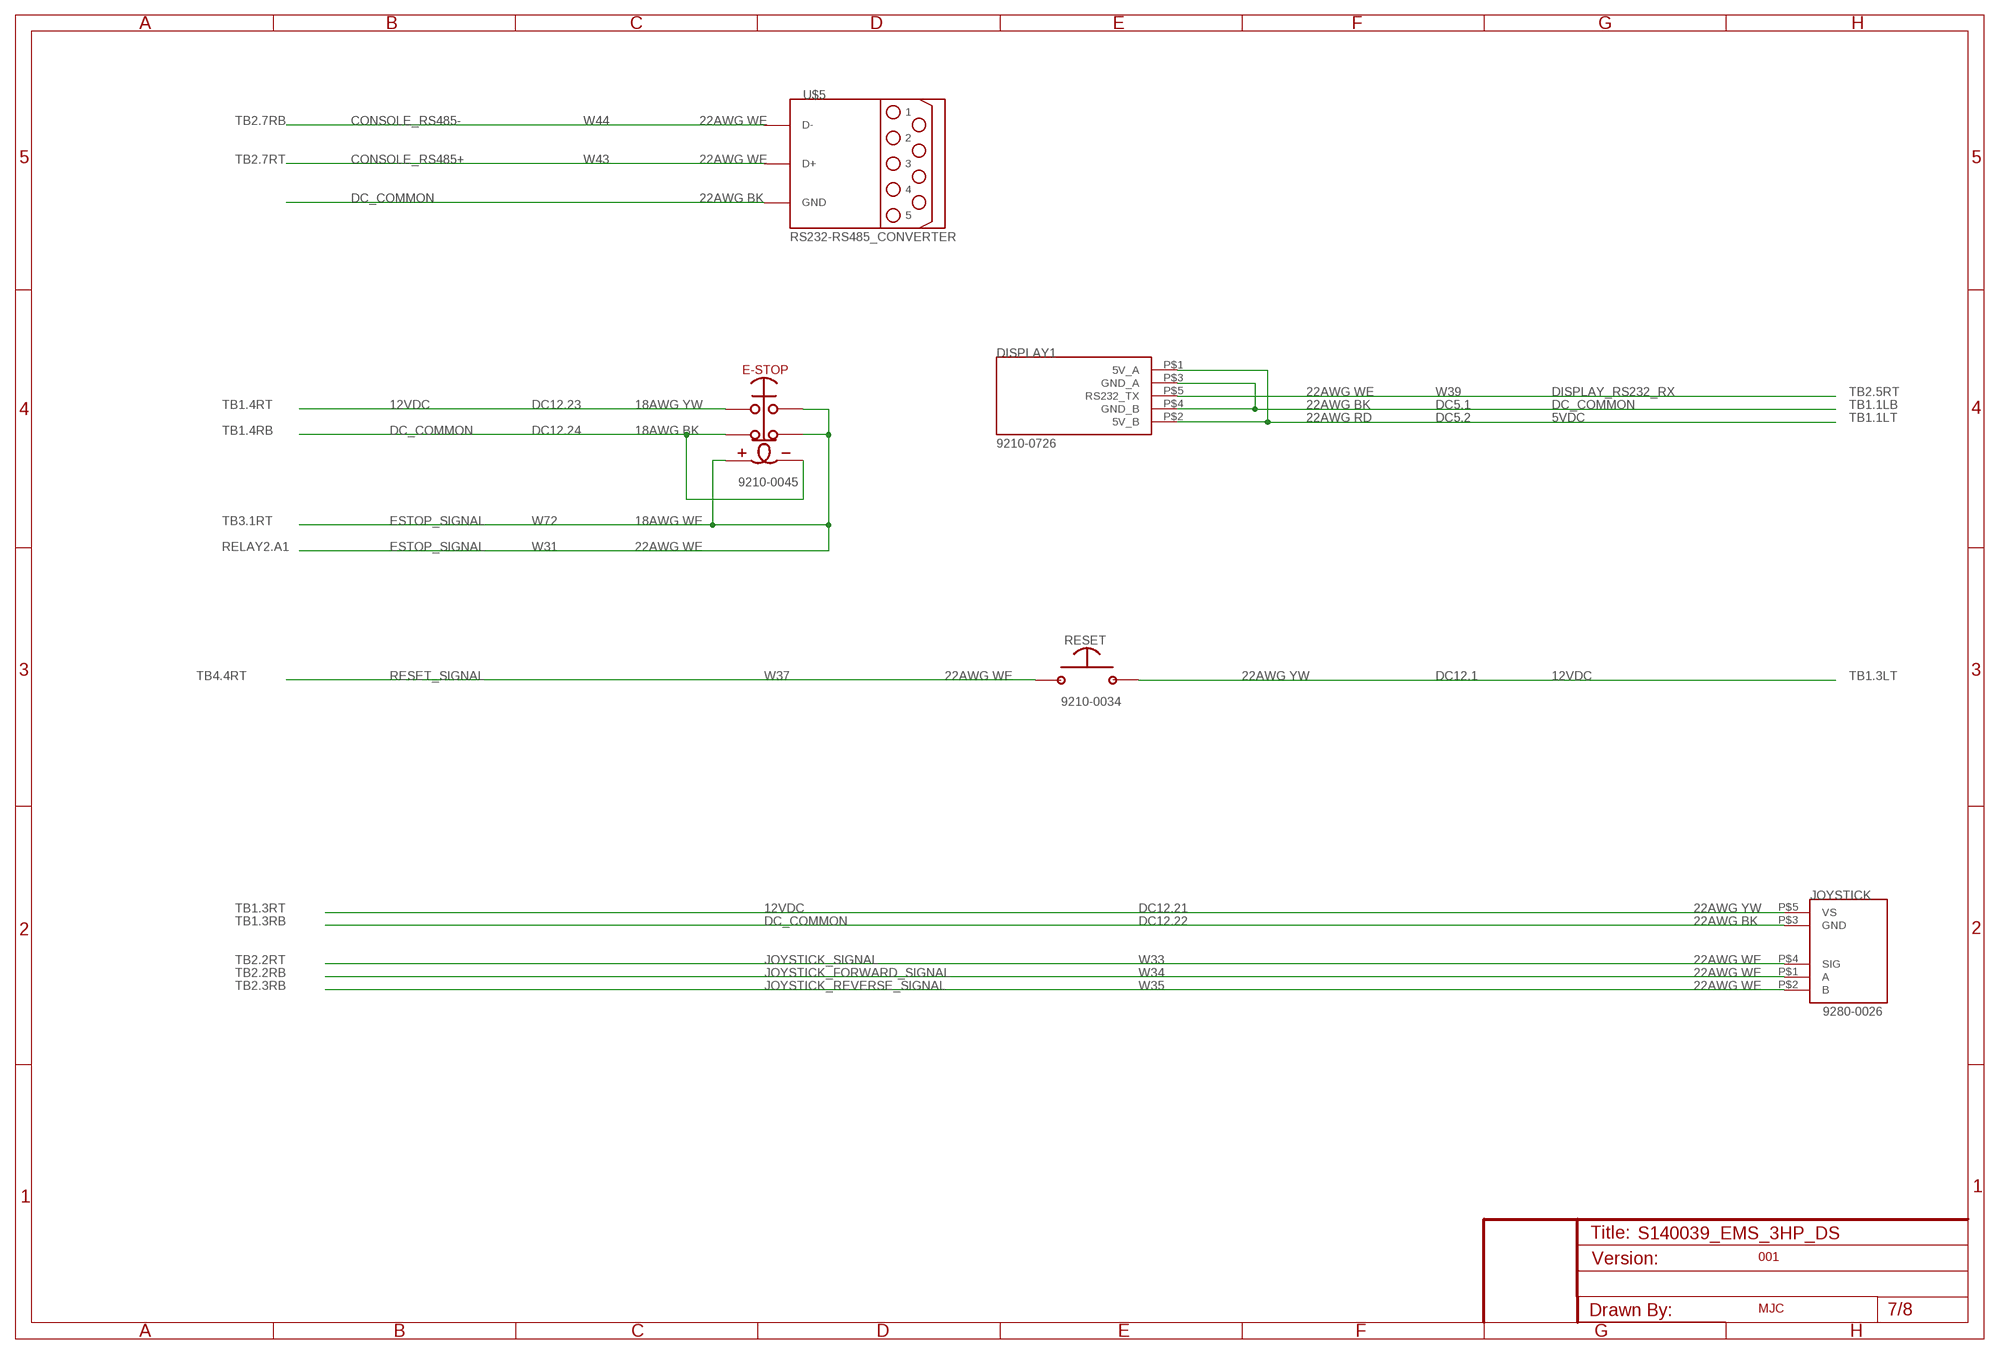
[diagram p6: schematic, sheet 7]

### Parts
DISPLAY1  SEETRON_GLO-416  [BOGUS]
JOYSTICK  JOYSTICK  [BOGUS]
RESET  SWITCH_MOM_NO  [BOGUS]
U$3  SWITCH_ESTOP_LIGHTED  [BOGUS]
U$5  RS232-RS485_CONVERTER  [BOGUS]

### Nets
5VDC: DISPLAY1.P$1(5V_A) DISPLAY1.P$2(5V_B) ; also sheet 2
12VDC: JOYSTICK.P$5(VS) RESET.P$2 U$3.P$1 ; also sheet 2,4,6,8
CONSOLE_RS485+: U$5.P$10(D+) ; also sheet 2,4
CONSOLE_RS485-: U$5.P$11(D-) ; also sheet 2,4
DC_COMMON: DISPLAY1.P$3(GND_A) DISPLAY1.P$4(GND_B) JOYSTICK.P$3(GND) U$3.P$2 U$3.P$6 U$5.P$12(GND) ; also sheet 2,3,4,5,6,8
DISPLAY_RS232_RX: DISPLAY1.P$5(RS232_TX) ; also sheet 2
ESTOP_SIGNAL: U$3.P$3 U$3.P$4 U$3.P$5 ; also sheet 2,3,4
JOYSTICK_FORWARD_SIGNAL: JOYSTICK.P$1(A) ; also sheet 2,4
JOYSTICK_REVERSE_SIGNAL: JOYSTICK.P$2(B) ; also sheet 2,4
JOYSTICK_SIGNAL: JOYSTICK.P$4(SIG) ; also sheet 2,4
RESET_SIGNAL: RESET.P$1 ; also sheet 2,4
Unconnected: U$5.P$1 U$5.P$2 U$5.P$3 U$5.P$4 U$5.P$5 U$5.P$6 U$5.P$7 U$5.P$8 U$5.P$9

### Notes on the sheet
- TB2.7RB | W44 | 22AWG WE
- TB2.7RT | W43 | 22AWG WE
- 22AWG BK
- 22AWG WE | W39 | TB2.5RT
- TB1.4RT | DC12.23 | 18AWG YW | 22AWG BK | DC5.1 | TB1.1LB
- 22AWG RD | DC5.2 | TB1.1LT
- TB1.4RB | DC12.24 | 18AWG BK
- 9210-0726
- 9210-0045
- TB3.1RT | W72 | 18AWG WE
- RELAY2.A1 | W31 | 22AWG WE
- TB4.4RT | W37 | 22AWG WE | 22AWG YW | DC12.1 | TB1.3LT
- 9210-0034
- TB1.3RT | DC12.21 | 22AWG YW
- TB1.3RB | DC12.22 | 22AWG BK
- TB2.2RT | W33 | 22AWG WE
- TB2.2RB | W34 | 22AWG WE
- TB2.3RB | W35 | 22AWG WE
- 9280-0026
- 001
- MJC

## Sheet 8 of 8: Motors, Sensors
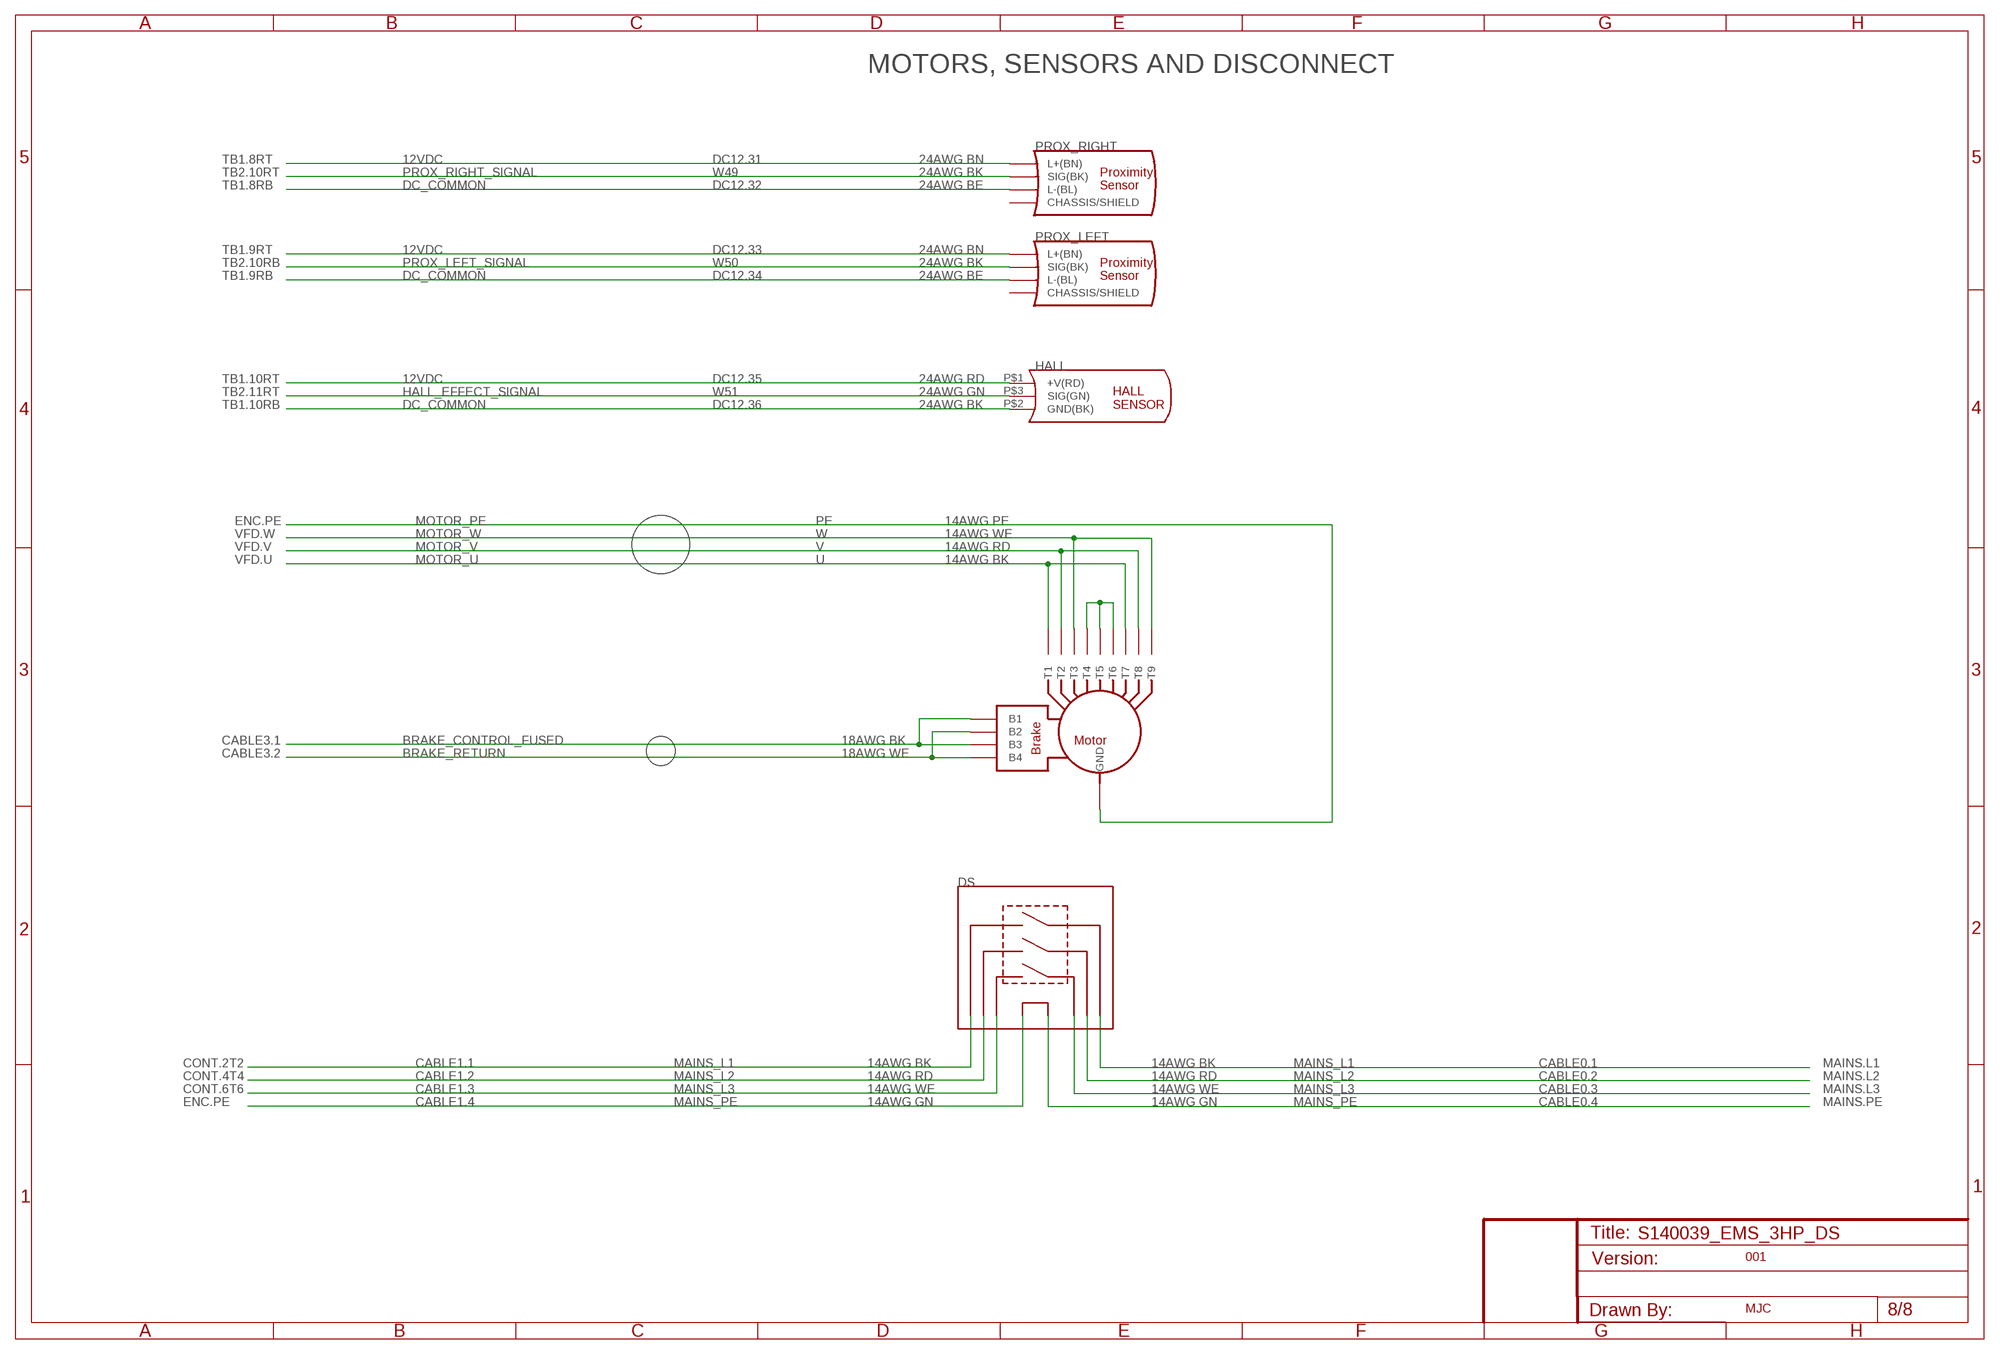
[diagram p7: schematic, sheet 8]

### Parts
DS  DISCONNECT_SWITCH  [BOGUS]
HALL  DRUM_SENSOR  [BOGUS]
U$11  MOTOR_3PH  [BOGUS]
U$12  SENSOR_PROXIMITY  [BOGUS]
U$13  SENSOR_PROXIMITY  [BOGUS]

### Nets
12VDC: HALL.P$1(+V(RD)) U$12.P$2(L+(BN)) U$13.P$2(L+(BN)) ; also sheet 2,4,6,7
BRAKE_CONTROL_FUSED: U$11.P$1(B1) U$11.P$3(B3) ; also sheet 6
BRAKE_RETURN: U$11.P$2(B2) U$11.P$4(B4) ; also sheet 6
DC_COMMON: HALL.P$2(GND(BK)) U$12.P$3(L-(BL)) U$13.P$3(L-(BL)) ; also sheet 2,3,4,5,6,7
HALL_EFFECT_SIGNAL: HALL.P$3(SIG(GN)) ; also sheet 2,4
MAINS_L1: DS.P$3 DS.P$4 ; also sheet 6
MAINS_L2: DS.P$2 DS.P$5 ; also sheet 6
MAINS_L3: DS.P$1 DS.P$6 ; also sheet 6
MAINS_PE: DS.P$7 DS.P$8
MOTOR_PE: U$11.P$14(GND) ; also sheet 5
MOTOR_U: U$11.P$5(T1) U$11.P$11(T7) ; also sheet 5
MOTOR_V: U$11.P$6(T2) U$11.P$12(T8) ; also sheet 5
MOTOR_W: U$11.P$7(T3) U$11.P$13(T9) ; also sheet 5
N$3: U$11.P$8(T4) U$11.P$9(T5) U$11.P$10(T6)
PROX_LEFT_SIGNAL: U$13.P$4(SIG(BK)) ; also sheet 2,4
PROX_RIGHT_SIGNAL: U$12.P$4(SIG(BK)) ; also sheet 2,4
Unconnected: U$12.P$1(CHASSIS/SHIELD) U$13.P$1(CHASSIS/SHIELD)

### Notes on the sheet
- MOTORS, SENSORS AND DISCONNECT
- PROX_RIGHT
- TB1.8RT | DC12.31 | 24AWG BN
- TB2.10RT | W49 | 24AWG BK
- TB1.8RB | DC12.32 | 24AWG BE
- PROX_LEFT
- TB1.9RT | DC12.33 | 24AWG BN
- TB2.10RB | W50 | 24AWG BK
- TB1.9RB | DC12.34 | 24AWG BE
- TB1.10RT | DC12.35 | 24AWG RD
- TB2.11RT | W51 | 24AWG GN
- TB1.10RB | DC12.36 | 24AWG BK
- ENC.PE | PE | 14AWG PE
- VFD.W | W | 14AWG WE
- VFD.V | V | 14AWG RD
- VFD.U | U | 14AWG BK
- CABLE3.1 | 18AWG BK
- CABLE3.2 | 18AWG WE
- CONT.2T2 | CABLE1.1 | 14AWG BK | 14AWG BK | CABLE0.1 | MAINS.L1
- CONT.4T4 | CABLE1.2 | 14AWG RD | 14AWG RD | CABLE0.2 | MAINS.L2
- CONT.6T6 | CABLE1.3 | 14AWG WE | 14AWG WE | CABLE0.3 | MAINS.L3
- ENC.PE | CABLE1.4 | 14AWG GN | 14AWG GN | CABLE0.4 | MAINS.PE
- 001
- MJC

## Library data of the parts
CONT1 = SOSI-Wiring-Diagram.rpt:CONTACTOR_3PHASE
CPU1 = DougM.SOSI.Microcontroller:RABBIT_BL4S200(RCM4310): 9210-0442 COMPUTER SINGLE-BOARD BL4S200 Rabbit Semiconductor 20-101-1220 Digi-Key 316-1164-ND
DBR1 DBR2 = resistor:R-DYNAMIC_BRAKE
DISPLAY1 = DougM-SOSI-Wiring-Diagram.rpt:SEETRON_GLO-416
DS = SOSI-Wiring-Diagram.rpt:DISCONNECT_SWITCH
FUSE1 = SOSI-Wiring-Diagram.rpt:FUSE_HOLDER_3-POLE: 9210-0086 BC6033PQ Fuseholder, Class CC & Class G, 3 pole, 600V, 30A, for 13/32x1 1/2 fuses Cooper/Bussman North Coast Electric
HALL = SOSI-Wiring-Diagram.rpt:DRUM_SENSOR
HBU = Inverters:HITACHI_HBU-2030
JOYSTICK = SOSI-Wiring-Diagram.rpt:JOYSTICK
PS1 = DougM-SOSI-Wiring-Diagram.rpt:DC-DC_CONVERTER_VGS-50-12
PS2 = DougM-SOSI-Wiring-Diagram.rpt:DC-DC_CONVERTER_24V-5V
R1 R2 = resistor:R-US_: RESISTOR, American symbol
RELAY1 RELAY2 = DougM-SOSI-Wiring-Diagram.rpt:RELAY_TB
RESET = DougM-SOSI-Wiring-Diagram.rpt:SWITCH_MOM_NO: 9210-0072 Mouser Part #: 850-59-313 Manufacturer Part #: 59-313
U$1 U$2 U$4 U$7 U$8 U$16-U$35 = SOSI-TerminalBlocks:TB_3031160_1POS
U$3 = DougM-SOSI-Wiring-Diagram.rpt:SWITCH_ESTOP_LIGHTED: 9210-0045 Switch, Emergency Stop, w/ #800T-XA4 contact block (old #800H-FRXTQH10RA4) Allen Bradley 800H-FRXTQH2RA4
U$5 = SOSI-Wiring-Diagram.rpt:RS232-RS485_CONVERTER
U$6 = SOSI-Wiring-Diagram.rpt:FUSE_HOLDER_2-POLE: 9210-0047 Cooper/Bussman BM6032SQ 9210-0194 Cooper/Bussman BK/S-8301-2-R
U$9 U$10 = SOSI-TerminalBlocks:TB_FUSE_DDFL4ULR
U$11 = SOSI-Wiring-Diagram.rpt:MOTOR_3PH: 9500-0000 113020 Electric motor, washdown, 1HP, 208-230/460VAC, 3 phase, 1725 RPM, 56C mounting 9500-0005 G120762 Electric Motor, Washdown, 2HP, 208-230/460V, 60Hz, Cont., 1800 RPM, TEFC, 145TC 9500-0007 CEWDBM3611T BrakeMotor, Electric, Washdown, 3HP, 208-230/460V, 1760RPM, 3 Ph., 60Hz, 182TC, TEFC 9500-0009 G140467.00 Electric Motor, Washdown, 7.5HP, 220 VAC, 50-60 Hz, 3 Phase, 213TC Frame, No Base Leeson Kaman Industrial Technologies McGuire Bearing
U$12 U$13 = DougM-SOSI-Wiring-Diagram.rpt:SENSOR_PROXIMITY: 9210-0023 Proximity Sensor, Inductive, 5mm Dia., 10-30 VDC, 3-wire, NPN, Shielded, 1.5mm nominal sensing distance, N.O., 2-meter cable 9210-0088 Proximity Sensor, Inductive, 12mm Dia., 10-30 VDC, 3-wire, unshielded, 8mm nominal sensing distance, N.O., 2-meter cable 9210-0191 Proximity Sensor, Inductive, 8mm Dia., extended range, 10-30 VDC, 3-wire, NPN, N.O., 4mm nominal sensing distance, unshielded 2-meter cable 9210-0284 Sensor, Proximity, Inductive, 18mm Dia., Extended Range, 10-30 VDC, 3 Wire, NPN, shielded, 2-Meter Cable Manufacturer Automation Direct
U$14 = SOSI-Wiring-Diagram.rpt:THERMISTOR: (no PN available) (no description available) Soundnine Inc. (no vendor PN available)
VFD = Inverters:HITACHI_WJ200-022LF